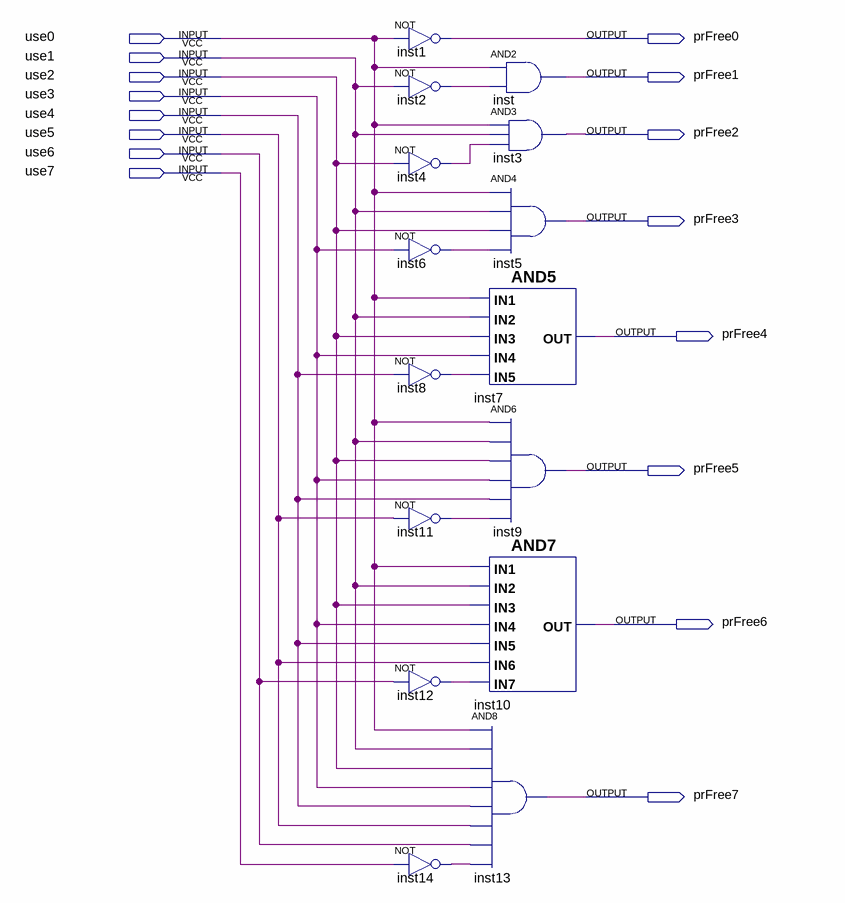
[diagram p0: schematic sheet]
// Quartus schematic Cascade_Free.bdf as structural Verilog: 15 symbols, 16 pins
module Cascade_Free (
  input  use0,
  input  use1,
  input  use2,
  input  use3,
  input  use4,
  input  use5,
  input  use6,
  input  use7,
  output prFree0,
  output prFree1,
  output prFree2,
  output prFree3,
  output prFree4,
  output prFree5,
  output prFree6,
  output prFree7
);

  wire inst2_out, inst4_out, inst6_out, inst8_out, inst11_out, inst12_out, inst14_out;

  not inst1 (prFree0, use0);
  not inst2 (inst2_out, use1);
  not inst4 (inst4_out, use2);
  not inst6 (inst6_out, use3);
  not inst8 (inst8_out, use4);
  not inst11 (inst11_out, use5);
  not inst12 (inst12_out, use6);
  not inst14 (inst14_out, use7);
  and inst (prFree1, use0, inst2_out);
  and inst3 (prFree2, use0, use1, inst4_out);
  and inst5 (prFree3, use0, use1, use2, inst6_out);
  and inst7 (prFree4, use0, use1, use2, use3, inst8_out);
  and inst9 (prFree5, use0, use1, use2, use3, use4, inst11_out);
  and inst10 (prFree6, use0, use1, use2, use3, use4, use5, inst12_out);
  and inst13 (prFree7, use0, use1, use2, use3, use4, use5, use6, inst14_out);
endmodule
